# Altium schematic sheet Main Sheet.SchDoc: Wackyraces Hat Main Schemetic
size A3; DrawnBy: Nathan James, Marcus Hughnan; Address1: ECE Department; Address2: University of Canterbury; Address3: Christchurch 8041; Address4: New Zealand; Revision: 1; SheetNumber: 1; SheetTotal: 2
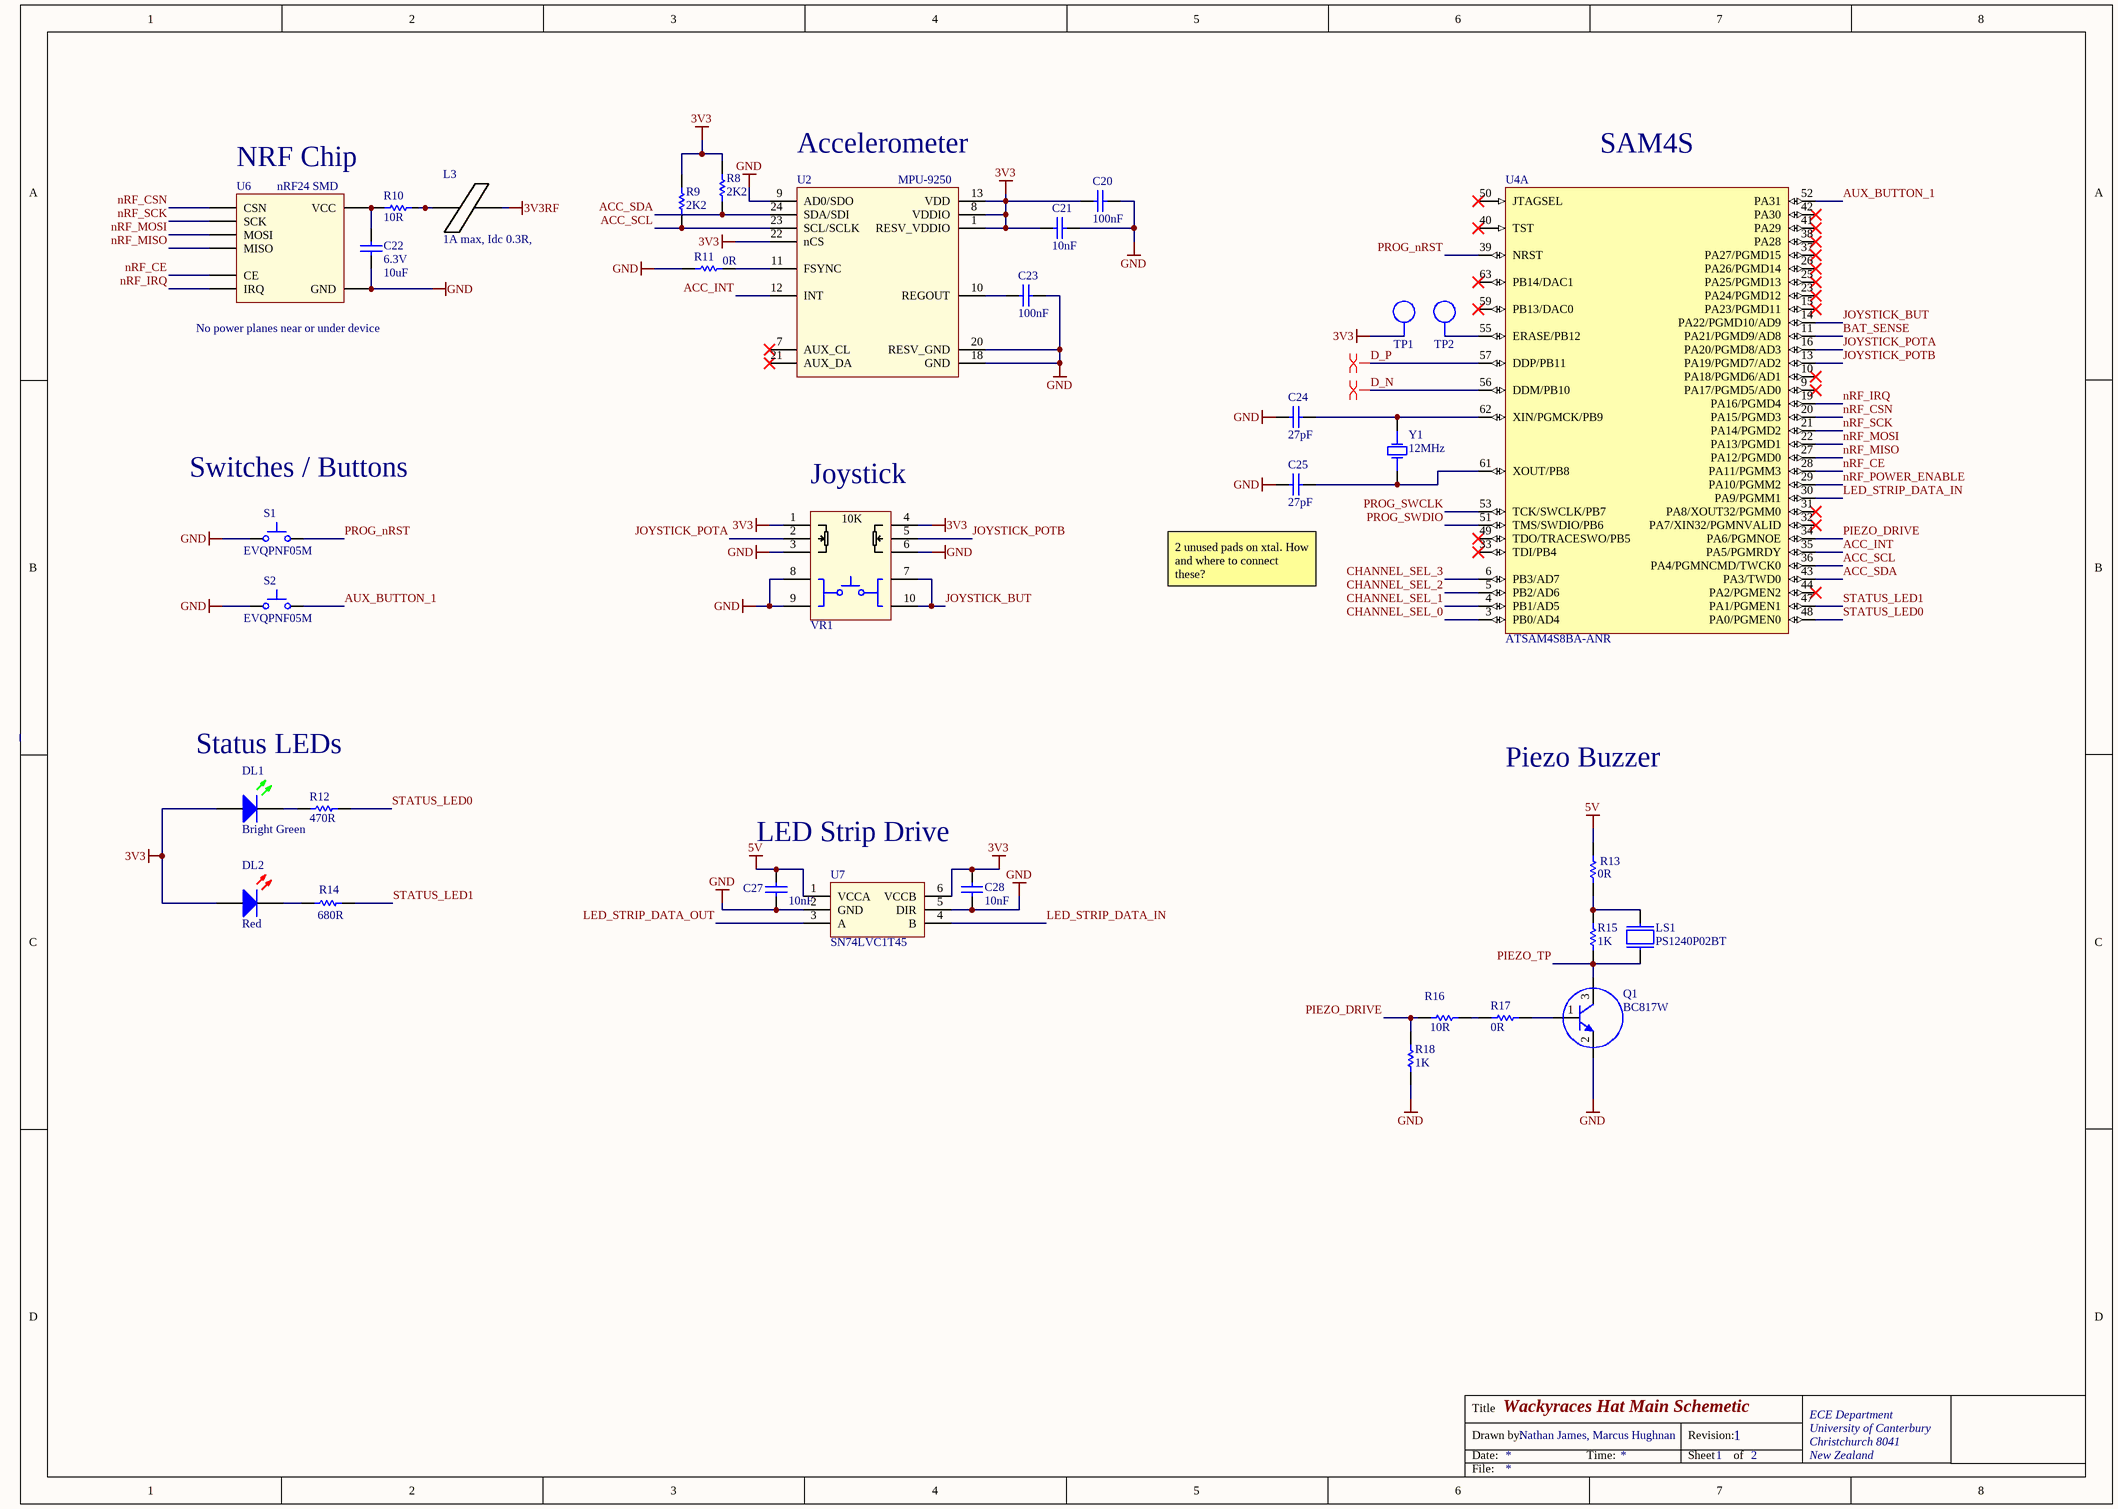
[diagram p0: Main Sheet.SchDoc]

## Parts
C20  100nF  [CAPC1608L]
C21  10nF  [CAPC1608L]
C22  Voltage - Rated: 6.3V  [CAPC1608L]  (hidden comment: 10uF)
C23  100nF  [CAPC1608L]
C24  27pF  [CAPC1608L]
C25  27pF  [CAPC1608L]
C27  10nF  [CAPC1608L]
C28  10nF  [CAPC1608L]
DL1  Bright Green  [WL-SMCW0603]
DL2  Red  [WL-SMCW0603]
L3  1A max, Idc 0.3R,  [INDC3216L]
LS1  PS1240P02BT  [XDCR_PS1240P02BT]
Q1  BC817W  [SOT323_M]
R8  2K2  [RESC1608L]
R9  2K2  [RESC1608L]
R10  10R  [RESC1608L]
R11  0R  [RESC1608L]
R12  470R  [RESC1608L]
R13  0R  [RESC1608L]
R14  680R  [RESC1608L]
R15  1K  [RESC1608L]
R16  10R  [RESC1608L]
R17  0R  [RESC1608L]
R18  1K  [RESC1608L]
S1  EVQPNF05M  [EVQPNF05M]
S2  EVQPNF05M  [EVQPNF05M]
TP1  Erase  [TP_1206]  (value not drawn)  (no BOM)
TP2  Erase  [TP_1206]  (value not drawn)  (no BOM)
U2  MPU-9250  [Quad24]
U4  ATSAM4S8BA-ANR  [LQFP64_L]  (part A of 2)
U6  nRF24 SMD  Warning: No power planes near or under device  [NRF24]
U7  SN74LVC1T45  [SOT23-6_N]
VR1  Joystick 10k with Sw  [Joystick_Sw]  (value not drawn)
Y1  12MHz  [6.0X3.5-4]

## Nets
3V3: C20.1 C21.1 C28.2 DL1.2(A) DL2.2(A) R8.2 R9.1 TP1.1 U2.1(RESV_VDDIO) U2.8(VDDIO) U2.13(VDD) U2.22(nCS) U7.6(VCCB) VR1.1 VR1.4(1')
3V3RF: L3.1
5V: C27.2 R13.2 U7.1(VCCA)
GND: C20.2 C21.2 C22.1 C23.2 C24.1 C25.1 C27.1 C28.1 Q1.2 R11.1 R18.1 S1.1 S2.1 U2.9(AD0/SDO) U2.18(GND) U2.20(RESV_GND) U6.2(GND) U7.2(GND) U7.5(DIR) VR1.3 VR1.6(3') VR1.8 VR1.9
ACC_INT: U2.12(INT) U4.35(PA5/PGMRDY)
ACC_SCL: R9.2 U2.23(SCL/SCLK) U4.36(PA4/PGMNCMD/TWCK0)
ACC_SDA: R8.1 U2.24(SDA/SDI) U4.43(PA3/TWD0)
AUX_BUTTON_1: S2.2 U4.52(PA31)
BAT_SENSE: U4.11(PA21/PGMD9/AD8)
CHANNEL_SEL_0: U4.3(PB0/AD4)
CHANNEL_SEL_1: U4.4(PB1/AD5)
CHANNEL_SEL_2: U4.5(PB2/AD6)
CHANNEL_SEL_3: U4.6(PB3/AD7)
D_N: U4.56(DDM/PB10)
D_P: U4.57(DDP/PB11)
JOYSTICK_BUT: U4.14(PA22/PGMD10/AD9) VR1.7 VR1.10
JOYSTICK_POTA: U4.16(PA20/PGMD8/AD3) VR1.2
JOYSTICK_POTB: U4.13(PA19/PGMD7/AD2) VR1.5(2')
LED_STRIP_DATA_IN: U4.30(PA9/PGMM1) U7.4(B)
LED_STRIP_DATA_OUT: U7.3(A)
nRF_CE: U4.28(PA11/PGMM3) U6.3(CE)
nRF_CSN: U4.20(PA15/PGMD3) U6.4(CSN)
nRF_IRQ: U4.19(PA16/PGMD4) U6.8(IRQ)
nRF_MISO: U4.27(PA12/PGMD0) U6.7(MISO)
nRF_MOSI: U4.22(PA13/PGMD1) U6.6(MOSI)
nRF_POWER_ENABLE: U4.29(PA10/PGMM2)
nRF_SCK: U4.21(PA14/PGMD2) U6.5(SCK)
PIEZO_DRIVE: R16.1 R18.2 U4.34(PA6/PGMNOE)
PIEZO_TP: LS1.1 Q1.3 R15.1
PROG_nRST: S1.2 U4.39(NRST)
PROG_SWCLK: U4.53(TCK/SWCLK/PB7)
PROG_SWDIO: U4.51(TMS/SWDIO/PB6)
STATUS_LED0: R12.2 U4.48(PA0/PGMEN0)
STATUS_LED1: R14.2 U4.47(PA1/PGMEN1)
NetC22_2: C22.2 R10.1 U6.1(VCC)
NetC23_1: C23.1 U2.10(REGOUT)
NetC24_2: C24.2 U4.62(XIN/PGMCK/PB9) Y1.3(OSC2)
NetC25_2: C25.2 U4.61(XOUT/PB8) Y1.1(OSC1)
NetDL1_1: DL1.1(K) R12.1
NetDL2_1: DL2.1(K) R14.1
NetL3_2: L3.2 R10.2
NetLS1_2: LS1.2 R13.1 R15.2
NetQ1_1: Q1.1 R17.2
NetR11_2: R11.2 U2.11(FSYNC)
NetR16_2: R16.2 R17.1
NetTP2_1: TP2.1 U4.55(ERASE/PB12)

Not connected (* = marked no-connect by the designer): U2 7(AUX_CL)* 21(AUX_DA)*; U4 9(PA17/PGMD5/AD0)* 10(PA18/PGMD6/AD1)* 15(PA23/PGMD11)* 23(PA24/PGMD12)* 25(PA25/PGMD13)* 26(PA26/PGMD14)* 31(PA8/XOUT32/PGMM0)* 32(PA7/XIN32/PGMNVALID)* 33(TDI/PB4)* 37(PA27/PGMD15)* 38(PA28)* 40(TST)* 41(PA29)* 42(PA30)* 44(PA2/PGMEN2)* 49(TDO/TRACESWO/PB5)* 50(JTAGSEL)* 59(PB13/DAC0)* 63(PB14/DAC1)*

## Layout directives
differential pair: D_N, D_P

## Notes on the sheet
- NRF Chip
- (near U2) Accelerometer
- (near U4) SAM4S
- Switches / Buttons
- (near VR1) Joystick
- (near C25) 2 unused pads on xtal. How and where to connect these?
- Status LEDs
- Piezo Buzzer
- LED Strip Drive
- Title
- Drawn by:
- Date:
- Time:
- Revision:
- Sheet
- of
- File:
- (in symbol Joystick 10k with Sw) 10K

## Library data of the parts
C20 C23 = CC_100nF_0603: CAP CER 100nF X7R +-10% 50V 0603; PackageReference: 0603; Code_IPC: 1608 [0603]; Verify: *; Supplier: ECE Dept; Storage Location: PCB Assembly WS; Value: 100nF
C21 C27 C28 = CC_10nF_0603: CAP CER 10nF X7R +-10% 50V 0603; PackageReference: 0603; Code_IPC: 1608 [0603]; Verify: *; Supplier: ECE Dept; Storage Location: PCB Assembly WS; Value: 10nF
C22 = CC_10uF_0603: CAP CER 10UF X5R +-20% 6V3 0603; Supplier: ECE Dept; Storage Location: PCB Assembly WS; Value: 10uF
C24 C25 = CC_27pF_0603: CAP CER 27pF NPO/COG +-5% 50V 0603; PackageReference: 0603; Code_IPC: 1608 [0603]; Verify: *; Supplier: ECE Dept; Storage Location: PCB Assembly WS; Value: 27pF
DL1 = DL_150060VS75000: LED Bright Green 40mcd 0603 SMD; Manufacturer: WURTH ELEKTRONIK; Forward Current If: 30; Forward Voltage: 2; Viewing Angle: 140°; Wavelength Typ: 570; Luminous Intensity: 40; LED Mounting: SMD; Supplier 1: Farnell; Supplier Part Number 1: 2322073; Manufacturer Part Number: 150060VS75000; Storage Location: PCB Assembly WS; Supplier: ECE Dept; LED Colour: Bright Green
DL2 = DL_150060RS75000: LED Red 250mcd 0603 SMD; Manufacturer: WURTH ELEKTRONIK; Forward Current If: 30; Forward Voltage: 2; Lens Shape: Rectangular; Luminous Intensity: 250; Wavelength Typ: 625; Viewing Angle: 140°; LED Mounting: SMD; Supplier 1: Farnell; Supplier Part Number 1: 2322071; Manufacturer Part Number: 150060RS75000; Storage Location: PCB Assembly WS; Supplier: ECE Dept; LED Colour: Red
L3 = IN_Ferrite-Bead: Ferrite Bead, Rdc 0.3R, Z100MHZ 600R, Imax 1A, SMD 1206; Manufacturer: FAIR-RITE; Manufacturer PN: 2512066017Y1; DC Current Rating: 1; DC Resistance Max: 0.08; Ferrite Case Style: 1206 ^3216 Metric]; Frequency Range: 50MHz to 1; Impedance: 600; Impedance Tolerance: ± 25%; Supplier: ECE Dept; Storage Location: PCB Assembly WS; Ferrite Mounting: SMD; Supplier 1: Farnell; Supplier Part Number 1: 1612060; Manufacturer Part Number: 2512066017Y1; Value: 1A max, Idc 0.3R,
LS1 = PS1240P02BT: Buzzers Transducer, Externally Driven Piezo 3V 4kHz 60dB @ 3V, 10cm Through Hole PC Pins; MF: TDK; MP: PS1240P02BT; Availability: Unavailable; Package: 2020 TDK; Value: *; Price: None; SnapEDA_Link: https://www.snapeda.com/parts/PS1240P02BT/TDK/view-part/53420/?ref=snap
Q1 = TB_BC817W: NPN GP Bipolar Transistor 45V 500mA SOT323; Manufacturer: NXP; Supplier 1: Farnell; Supplier Part Number 1: 2114873; Manufacturer PN: BC817W; Storage Location: PCB Assembly WS; Supplier: ECE Dept; Value: BC817W
R8 R9 = RS_2K2: RES 2.2K OHM 1/10W 5% 0603 SMD; Storage Location: PCB Assembly WS; Supplier: ECE Dept; Value: 2K2
R10 R16 = RS_10R: RES 10 OHM 1/10W 5% 0603 SMD; Storage Location: PCB Assembly WS; Supplier: ECE Dept; Value: 10R
R11 R13 R17 = RS_0R0: RES 0.0 OHM 1/10W 5% 0603 SMD; Storage Location: PCB Assembly WS; Supplier: ECE Dept; Value: 0R
R12 = RS_470R: RES 470 OHM 1/10W 5% 0603 SMD; Storage Location: PCB Assembly WS; Supplier: ECE Dept; Value: 470R
R14 = RS_680R: RES 680 OHM 1/10W 5% 0603 SMD; Storage Location: PCB Assembly WS; Supplier: ECE Dept; Value: 680R
R15 R18 = RS_1K: RES 1.0K OHM 1/10W 5% 0603 SMD; Storage Location: PCB Assembly WS; Supplier: ECE Dept; Value: 1K
S1 S2 = WS_EVQPNF05M: Panasonic 6 x 3.5mm SMD Light Touch Switch Type SMD; PackageDescription: 6.0 x 3.5 mm; Supplier 1: Farnell; Supplier Part Number 1: 2079481; Manufacturer: Panasonic; Manufacturer PN: EVQPNF05M; Supplier 2: Digi-Key; Supplier Part Number 2: P13598SCT-ND; Storage Location: PCB Assembly WS; Supplier: ECE Dept
TP1 TP2 = TP_1206: Test-Point 3.3x1.6x2.1mm SMD; Manufacturer: Harwin Inc; Manufacturer Part Number: S1751-46R; Value: TP; Manufacturer PN: *; Storage Location: ProtoPlace; Mounting Type: Surface Mount; Type: PC Test Point; Supplier 1: Digi-Key; Supplier Part Number 1: 952-1478-2-ND; Supplier 2: Farnell; Supplier Part Number 2: 1826282; Supplier: ECE Dept
U2 = MPU-9250: 9 axis IMU
U4 = SE_ATSAM4S16BA-MU: IC MCU 32BIT 512KB FLASH 64LQFP; Manufacturer: Atmel; Connectivity: I²C, IrDA, Memory Card, SPI, SSC, UART/USART, USB; Core Processor: ARM® Cortex®-M4; Core Size: 32-Bit; Data Converters: A/D 11x12b, D/A 2x12b; Number of I/O: 47; Peripherals: Brown-out Detect/Reset, DMA, POR, PWM, WDT; Program Memory Size: 512KB (512K x 8); RAM Size: 128K x 8; Speed: 120MHz; Voltage - Supply (Vcc/Vdd): 1.62 V ~ 3.6 V; PackageVersion: revJ, Jul-2007; PackageReference: 64PS; PackageDescription: 64-Pin Quad Flat No-Lead (QFN) Sawn, 9 x 9 x 1.0 mm Body, 0.5 mm Pitch, Exposed Pad; Code_JEDEC: MO-220VMMD-3; ComponentLink1Description: Manufacturer URL; ComponentLink1URL: http://www.atmel.com/; ComponentLink2Description: SAM4S Series Datasheet; ComponentLink2URL: http://www.atmel.com/dyn/resources/prod_documents/11100.pdf; ComponentLink3Description: SAM4S Series Summary; ComponentLink3URL: http://www.atmel.com/dyn/resources/prod_documents/11100S.pdf; Supplier 1: Digi-Key; Package / Case: 64-LQFP; Packaging: Cut Tape (CT); Program Memory Type: FLASH; Supplier Part Number 1: ATSAM4S8BA-ANRCT-ND; Manufacturer Part Number: ATSAM4S8BA-ANR
U6 = NRF24: nRF24 SMD Module
U7 = SN74LVC1T45: 1.8V - 5V level converter
VR1 = Joystick 10k with Sw: JOYSTICK 10K OHM 2 AXIS TH; Manufacturer 1: SparkFun; Manufacturer Part Number 1: COM-09032; Supplier 1: Digi-Key; Stock 1: 563; Pricing 1: 1=3.95000 (USD); RoHS: No; ComponentLink1URL: https://media.digikey.com/pdf/Data%20Sheets/Sparkfun%20PDFs/COM-09032_Web.pdf?src-supplier=Digi-Key; ComponentLink1Description: https://media.digikey.com/pdf/Data%20Sheets/Sparkfun%20PDFs/COM-09032_Web.pdf?src-supplier=Digi-Key; Supplier Part Number 1: 1568-1526-ND
Y1 = XT_CRYSTAL_12MHz_18pF: CRYSTAL 12MHZ 18PF 6X3.5mm SMD; Manufacturer: CTS-Frequency Controls; Manufacturer Part Number: 406C35D12M00000; ESR (Equivalent Series Resistance): 60 Ohm; Frequency Stability: ±50ppm; Frequency Tolerance: ±30ppm; Operating Mode: Fundamental; Supplier 1: Digi-Key; Height: 0.047" (1.20mm); Load Capacitance: 18pF; Mounting Type: Surface Mount; Operating Temperature: -20°C ~ 70°C; Package / Case: 4-SMD, No Lead (DFN, LCC); Size / Dimension: 0.236" L x 0.138" W (6.00mm x 3.50mm); Supplier Part Number 1: CTX855CT-ND; Frequency: 12MHz